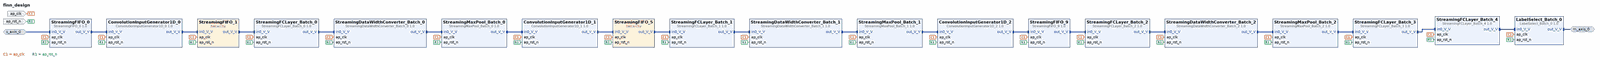
[diagram p0: block diagram of the top level, whole]
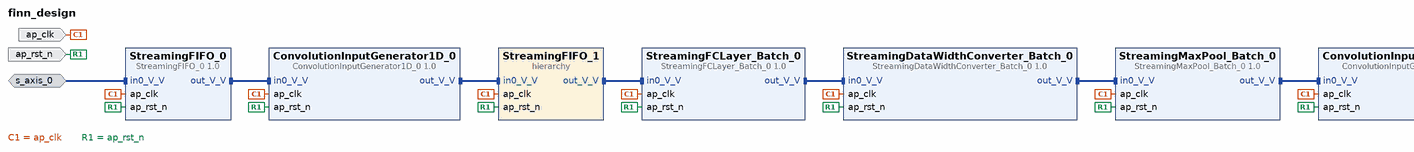
[diagram p1: block diagram of the top level, left part]
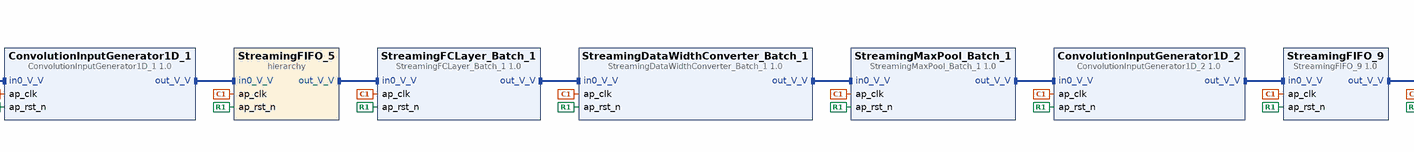
[diagram p2: block diagram of the top level, centre part]
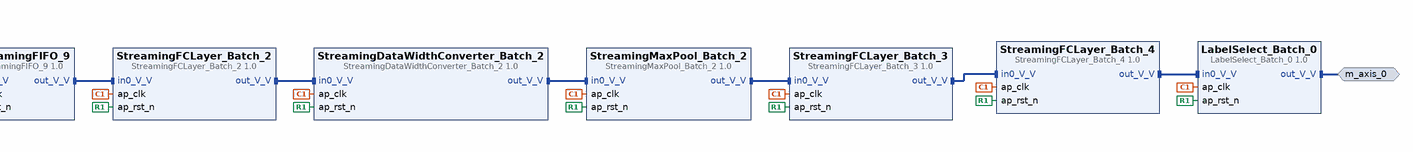
[diagram p3: block diagram of the top level, right part]
# Vivado block design finn_design, xc7a50tfgg484-1, Vivado 2020.1
create_bd_design finn_design

create_bd_intf_port -mode Slave -vlnv xilinx.com:interface:axis_rtl:1.0 s_axis_0
set_property -dict [list \
  CONFIG.TDATA_NUM_BYTES 1 \
  CONFIG.TDEST_WIDTH 0 \
  CONFIG.TID_WIDTH 0 \
  CONFIG.TUSER_WIDTH 0 \
  CONFIG.HAS_TREADY 1 \
  CONFIG.HAS_TSTRB 0 \
  CONFIG.HAS_TKEEP 0 \
  CONFIG.HAS_TLAST 0 \
  CONFIG.FREQ_HZ 50000000.000000 \
  CONFIG.LAYERED_METADATA undef \
] [get_bd_intf_ports s_axis_0]
create_bd_intf_port -mode Master -vlnv xilinx.com:interface:axis_rtl:1.0 m_axis_0
set_property -dict {CONFIG.FREQ_HZ 50000000.000000} [get_bd_intf_ports m_axis_0]
create_bd_port -dir I -type clk ap_clk
set_property -dict {CONFIG.FREQ_HZ 50000000.000000} [get_bd_ports ap_clk]
create_bd_port -dir I -type rst ap_rst_n

create_bd_cell -type ip -vlnv xilinx.com:hls:StreamingFIFO_0:1.0 StreamingFIFO_0
create_bd_cell -type ip -vlnv xilinx.com:hls:ConvolutionInputGenerator1D_0:1.0 ConvolutionInputGenerator1D_0
create_bd_cell -type hier StreamingFIFO_1
create_bd_cell -type ip -vlnv xilinx.com:hls:StreamingFCLayer_Batch_0:1.0 StreamingFCLayer_Batch_0
create_bd_cell -type ip -vlnv xilinx.com:hls:StreamingDataWidthConverter_Batch_0:1.0 StreamingDataWidthConverter_Batch_0
create_bd_cell -type ip -vlnv xilinx.com:hls:StreamingMaxPool_Batch_0:1.0 StreamingMaxPool_Batch_0
create_bd_cell -type ip -vlnv xilinx.com:hls:ConvolutionInputGenerator1D_1:1.0 ConvolutionInputGenerator1D_1
create_bd_cell -type hier StreamingFIFO_5
create_bd_cell -type ip -vlnv xilinx.com:hls:StreamingFCLayer_Batch_1:1.0 StreamingFCLayer_Batch_1
create_bd_cell -type ip -vlnv xilinx.com:hls:StreamingDataWidthConverter_Batch_1:1.0 StreamingDataWidthConverter_Batch_1
create_bd_cell -type ip -vlnv xilinx.com:hls:StreamingMaxPool_Batch_1:1.0 StreamingMaxPool_Batch_1
create_bd_cell -type ip -vlnv xilinx.com:hls:ConvolutionInputGenerator1D_2:1.0 ConvolutionInputGenerator1D_2
create_bd_cell -type ip -vlnv xilinx.com:hls:StreamingFIFO_9:1.0 StreamingFIFO_9
create_bd_cell -type ip -vlnv xilinx.com:hls:StreamingFCLayer_Batch_2:1.0 StreamingFCLayer_Batch_2
create_bd_cell -type ip -vlnv xilinx.com:hls:StreamingDataWidthConverter_Batch_2:1.0 StreamingDataWidthConverter_Batch_2
create_bd_cell -type ip -vlnv xilinx.com:hls:StreamingMaxPool_Batch_2:1.0 StreamingMaxPool_Batch_2
create_bd_cell -type ip -vlnv xilinx.com:hls:StreamingFCLayer_Batch_3:1.0 StreamingFCLayer_Batch_3
create_bd_cell -type ip -vlnv xilinx.com:hls:StreamingFCLayer_Batch_4:1.0 StreamingFCLayer_Batch_4
create_bd_cell -type ip -vlnv xilinx.com:hls:LabelSelect_Batch_0:1.0 LabelSelect_Batch_0

# ---- hierarchy /StreamingFIFO_1 ----
current_bd_instance /StreamingFIFO_1
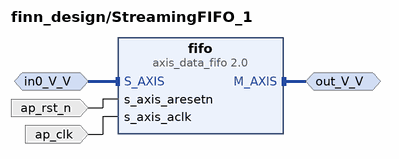
[diagram p4: block diagram inside /StreamingFIFO_1]
create_bd_intf_pin -mode Master -vlnv xilinx.com:interface:axis_rtl:1.0 out_V_V
create_bd_intf_pin -mode Slave -vlnv xilinx.com:interface:axis_rtl:1.0 in0_V_V
create_bd_pin -dir I -type clk ap_clk
create_bd_pin -dir I -type rst ap_rst_n

create_bd_cell -type ip -vlnv xilinx.com:ip:axis_data_fifo:2.0 fifo
set_property -dict {CONFIG.FIFO_DEPTH 8192 CONFIG.FIFO_MEMORY_TYPE distributed CONFIG.TDATA_NUM_BYTES 1} [get_bd_cells fifo]

# ---- hierarchy /StreamingFIFO_5 ----
current_bd_instance /StreamingFIFO_5
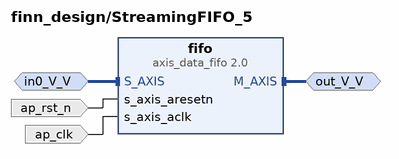
[diagram p5: block diagram inside /StreamingFIFO_5]
create_bd_intf_pin -mode Master -vlnv xilinx.com:interface:axis_rtl:1.0 out_V_V
create_bd_intf_pin -mode Slave -vlnv xilinx.com:interface:axis_rtl:1.0 in0_V_V
create_bd_pin -dir I -type clk ap_clk
create_bd_pin -dir I -type rst ap_rst_n

create_bd_cell -type ip -vlnv xilinx.com:ip:axis_data_fifo:2.0 fifo
set_property -dict {CONFIG.FIFO_DEPTH 2048 CONFIG.FIFO_MEMORY_TYPE distributed CONFIG.TDATA_NUM_BYTES 4} [get_bd_cells fifo]

# ---- connections ----

current_bd_instance /StreamingFIFO_1
connect_bd_intf_net [get_bd_intf_pins out_V_V] [get_bd_intf_pins fifo/M_AXIS]
connect_bd_intf_net [get_bd_intf_pins in0_V_V] [get_bd_intf_pins fifo/S_AXIS]
connect_bd_net [get_bd_pins ap_rst_n] [get_bd_pins fifo/s_axis_aresetn]
connect_bd_net [get_bd_pins ap_clk] [get_bd_pins fifo/s_axis_aclk]

current_bd_instance /StreamingFIFO_5
connect_bd_intf_net [get_bd_intf_pins out_V_V] [get_bd_intf_pins fifo/M_AXIS]
connect_bd_intf_net [get_bd_intf_pins in0_V_V] [get_bd_intf_pins fifo/S_AXIS]
connect_bd_net [get_bd_pins ap_rst_n] [get_bd_pins fifo/s_axis_aresetn]
connect_bd_net [get_bd_pins ap_clk] [get_bd_pins fifo/s_axis_aclk]

current_bd_instance /
connect_bd_intf_net [get_bd_intf_pins StreamingMaxPool_Batch_2/out_V_V] [get_bd_intf_pins StreamingFCLayer_Batch_3/in0_V_V]
connect_bd_intf_net -intf_net in0_V_V_0_1 [get_bd_intf_ports s_axis_0] [get_bd_intf_pins StreamingFIFO_0/in0_V_V]
connect_bd_intf_net [get_bd_intf_pins StreamingFIFO_0/out_V_V] [get_bd_intf_pins ConvolutionInputGenerator1D_0/in0_V_V]
connect_bd_intf_net [get_bd_intf_pins ConvolutionInputGenerator1D_0/out_V_V] [get_bd_intf_pins StreamingFIFO_1/in0_V_V]
connect_bd_intf_net [get_bd_intf_pins StreamingFIFO_1/out_V_V] [get_bd_intf_pins StreamingFCLayer_Batch_0/in0_V_V]
connect_bd_intf_net [get_bd_intf_pins StreamingFCLayer_Batch_0/out_V_V] [get_bd_intf_pins StreamingDataWidthConverter_Batch_0/in0_V_V]
connect_bd_intf_net [get_bd_intf_pins StreamingDataWidthConverter_Batch_0/out_V_V] [get_bd_intf_pins StreamingMaxPool_Batch_0/in0_V_V]
connect_bd_intf_net [get_bd_intf_pins StreamingMaxPool_Batch_0/out_V_V] [get_bd_intf_pins ConvolutionInputGenerator1D_1/in0_V_V]
connect_bd_intf_net [get_bd_intf_pins ConvolutionInputGenerator1D_1/out_V_V] [get_bd_intf_pins StreamingFIFO_5/in0_V_V]
connect_bd_intf_net [get_bd_intf_pins StreamingFIFO_5/out_V_V] [get_bd_intf_pins StreamingFCLayer_Batch_1/in0_V_V]
connect_bd_intf_net [get_bd_intf_pins StreamingFCLayer_Batch_1/out_V_V] [get_bd_intf_pins StreamingDataWidthConverter_Batch_1/in0_V_V]
connect_bd_intf_net [get_bd_intf_pins StreamingDataWidthConverter_Batch_1/out_V_V] [get_bd_intf_pins StreamingMaxPool_Batch_1/in0_V_V]
connect_bd_intf_net [get_bd_intf_pins StreamingMaxPool_Batch_1/out_V_V] [get_bd_intf_pins ConvolutionInputGenerator1D_2/in0_V_V]
connect_bd_intf_net [get_bd_intf_pins ConvolutionInputGenerator1D_2/out_V_V] [get_bd_intf_pins StreamingFIFO_9/in0_V_V]
connect_bd_intf_net [get_bd_intf_pins StreamingFIFO_9/out_V_V] [get_bd_intf_pins StreamingFCLayer_Batch_2/in0_V_V]
connect_bd_intf_net [get_bd_intf_pins StreamingFCLayer_Batch_2/out_V_V] [get_bd_intf_pins StreamingDataWidthConverter_Batch_2/in0_V_V]
connect_bd_intf_net [get_bd_intf_pins StreamingDataWidthConverter_Batch_2/out_V_V] [get_bd_intf_pins StreamingMaxPool_Batch_2/in0_V_V]
connect_bd_intf_net [get_bd_intf_pins StreamingFCLayer_Batch_3/out_V_V] [get_bd_intf_pins StreamingFCLayer_Batch_4/in0_V_V]
connect_bd_intf_net [get_bd_intf_pins StreamingFCLayer_Batch_4/out_V_V] [get_bd_intf_pins LabelSelect_Batch_0/in0_V_V]
connect_bd_intf_net [get_bd_intf_ports m_axis_0] [get_bd_intf_pins LabelSelect_Batch_0/out_V_V]
connect_bd_net -net ap_clk_0_1 [get_bd_ports ap_clk] \
  [get_bd_pins StreamingFIFO_0/ap_clk] [get_bd_pins ConvolutionInputGenerator1D_0/ap_clk] \
  [get_bd_pins StreamingFIFO_1/ap_clk] [get_bd_pins StreamingFCLayer_Batch_0/ap_clk] \
  [get_bd_pins StreamingDataWidthConverter_Batch_0/ap_clk] [get_bd_pins StreamingMaxPool_Batch_0/ap_clk] \
  [get_bd_pins ConvolutionInputGenerator1D_1/ap_clk] [get_bd_pins StreamingFIFO_5/ap_clk] \
  [get_bd_pins StreamingFCLayer_Batch_1/ap_clk] [get_bd_pins StreamingDataWidthConverter_Batch_1/ap_clk] \
  [get_bd_pins StreamingMaxPool_Batch_1/ap_clk] [get_bd_pins ConvolutionInputGenerator1D_2/ap_clk] \
  [get_bd_pins StreamingFIFO_9/ap_clk] [get_bd_pins StreamingFCLayer_Batch_2/ap_clk] \
  [get_bd_pins StreamingDataWidthConverter_Batch_2/ap_clk] [get_bd_pins StreamingMaxPool_Batch_2/ap_clk] \
  [get_bd_pins StreamingFCLayer_Batch_3/ap_clk] [get_bd_pins StreamingFCLayer_Batch_4/ap_clk] \
  [get_bd_pins LabelSelect_Batch_0/ap_clk]
connect_bd_net -net ap_rst_n_0_1 [get_bd_ports ap_rst_n] \
  [get_bd_pins StreamingFIFO_0/ap_rst_n] [get_bd_pins ConvolutionInputGenerator1D_0/ap_rst_n] \
  [get_bd_pins StreamingFIFO_1/ap_rst_n] [get_bd_pins StreamingFCLayer_Batch_0/ap_rst_n] \
  [get_bd_pins StreamingDataWidthConverter_Batch_0/ap_rst_n] [get_bd_pins StreamingMaxPool_Batch_0/ap_rst_n] \
  [get_bd_pins ConvolutionInputGenerator1D_1/ap_rst_n] [get_bd_pins StreamingFIFO_5/ap_rst_n] \
  [get_bd_pins StreamingFCLayer_Batch_1/ap_rst_n] [get_bd_pins StreamingDataWidthConverter_Batch_1/ap_rst_n] \
  [get_bd_pins StreamingMaxPool_Batch_1/ap_rst_n] [get_bd_pins ConvolutionInputGenerator1D_2/ap_rst_n] \
  [get_bd_pins StreamingFIFO_9/ap_rst_n] [get_bd_pins StreamingFCLayer_Batch_2/ap_rst_n] \
  [get_bd_pins StreamingDataWidthConverter_Batch_2/ap_rst_n] [get_bd_pins StreamingMaxPool_Batch_2/ap_rst_n] \
  [get_bd_pins StreamingFCLayer_Batch_3/ap_rst_n] [get_bd_pins StreamingFCLayer_Batch_4/ap_rst_n] \
  [get_bd_pins LabelSelect_Batch_0/ap_rst_n]

validate_bd_design
save_bd_design
